# Altium schematic sheet Conn_C.SchDoc
size A1
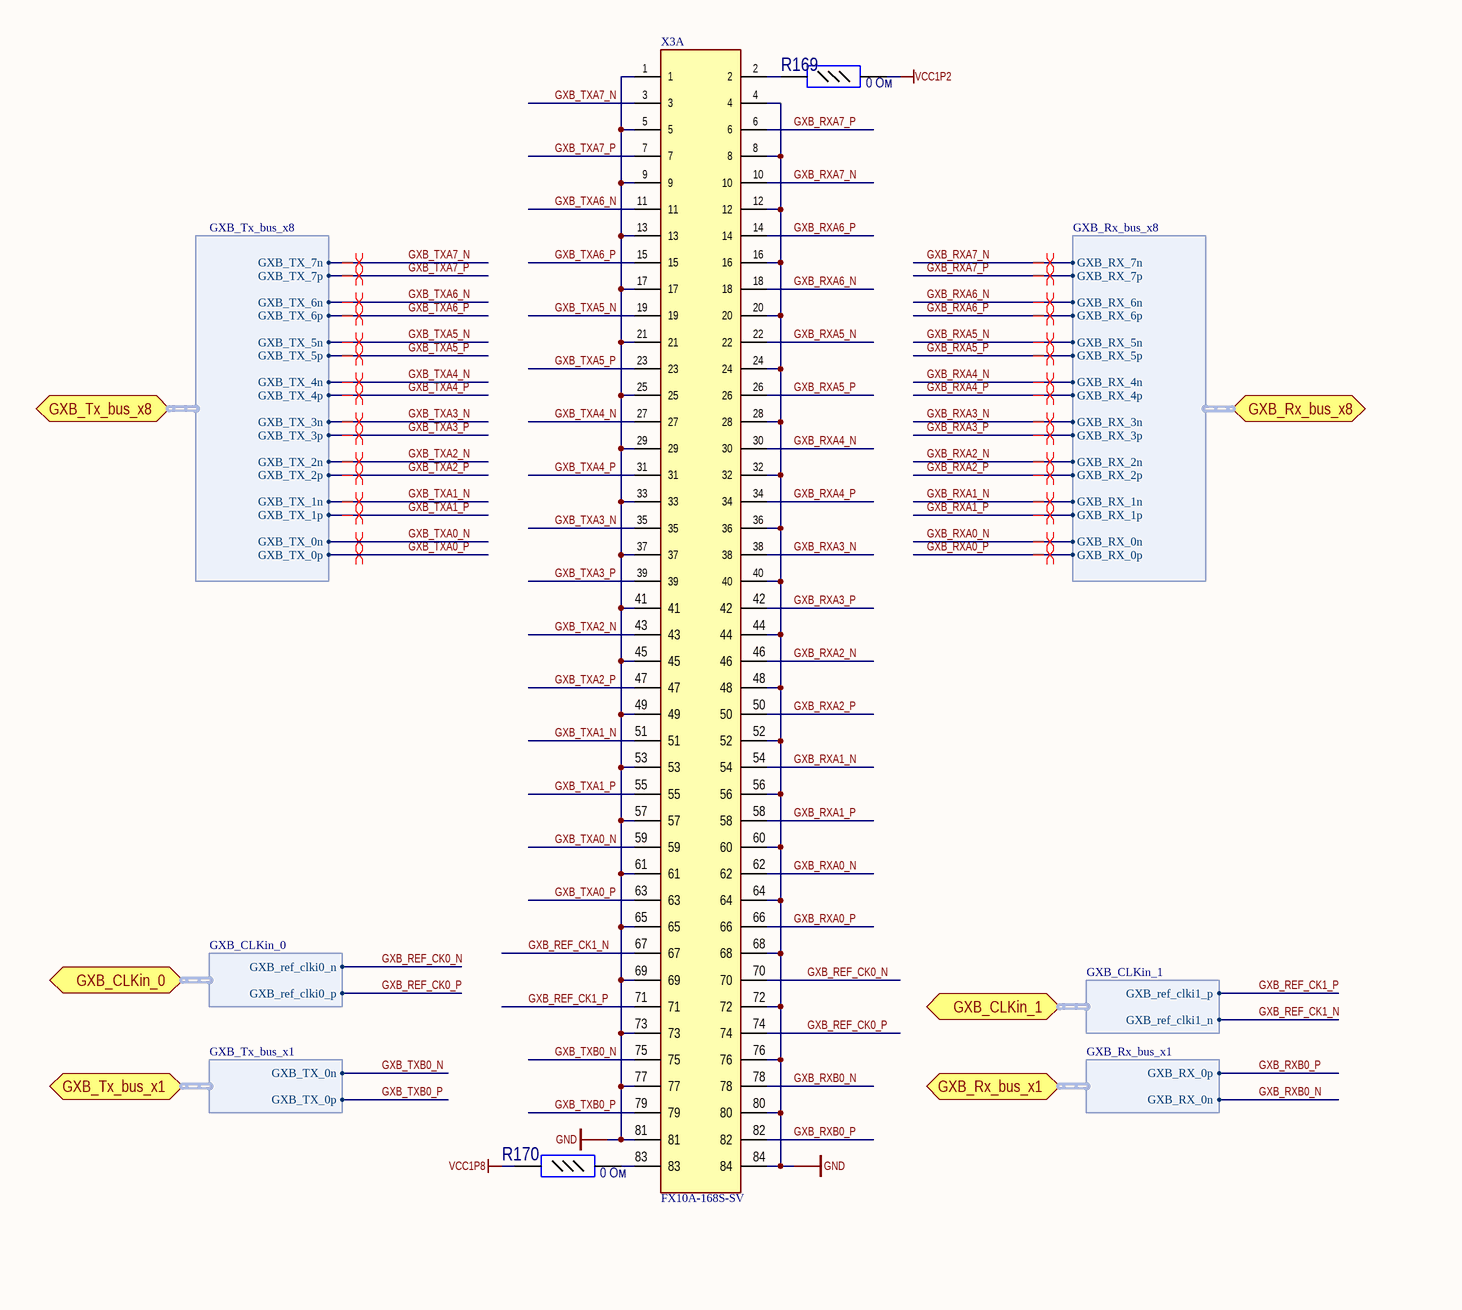
[diagram p0: Conn_C.SchDoc, left]
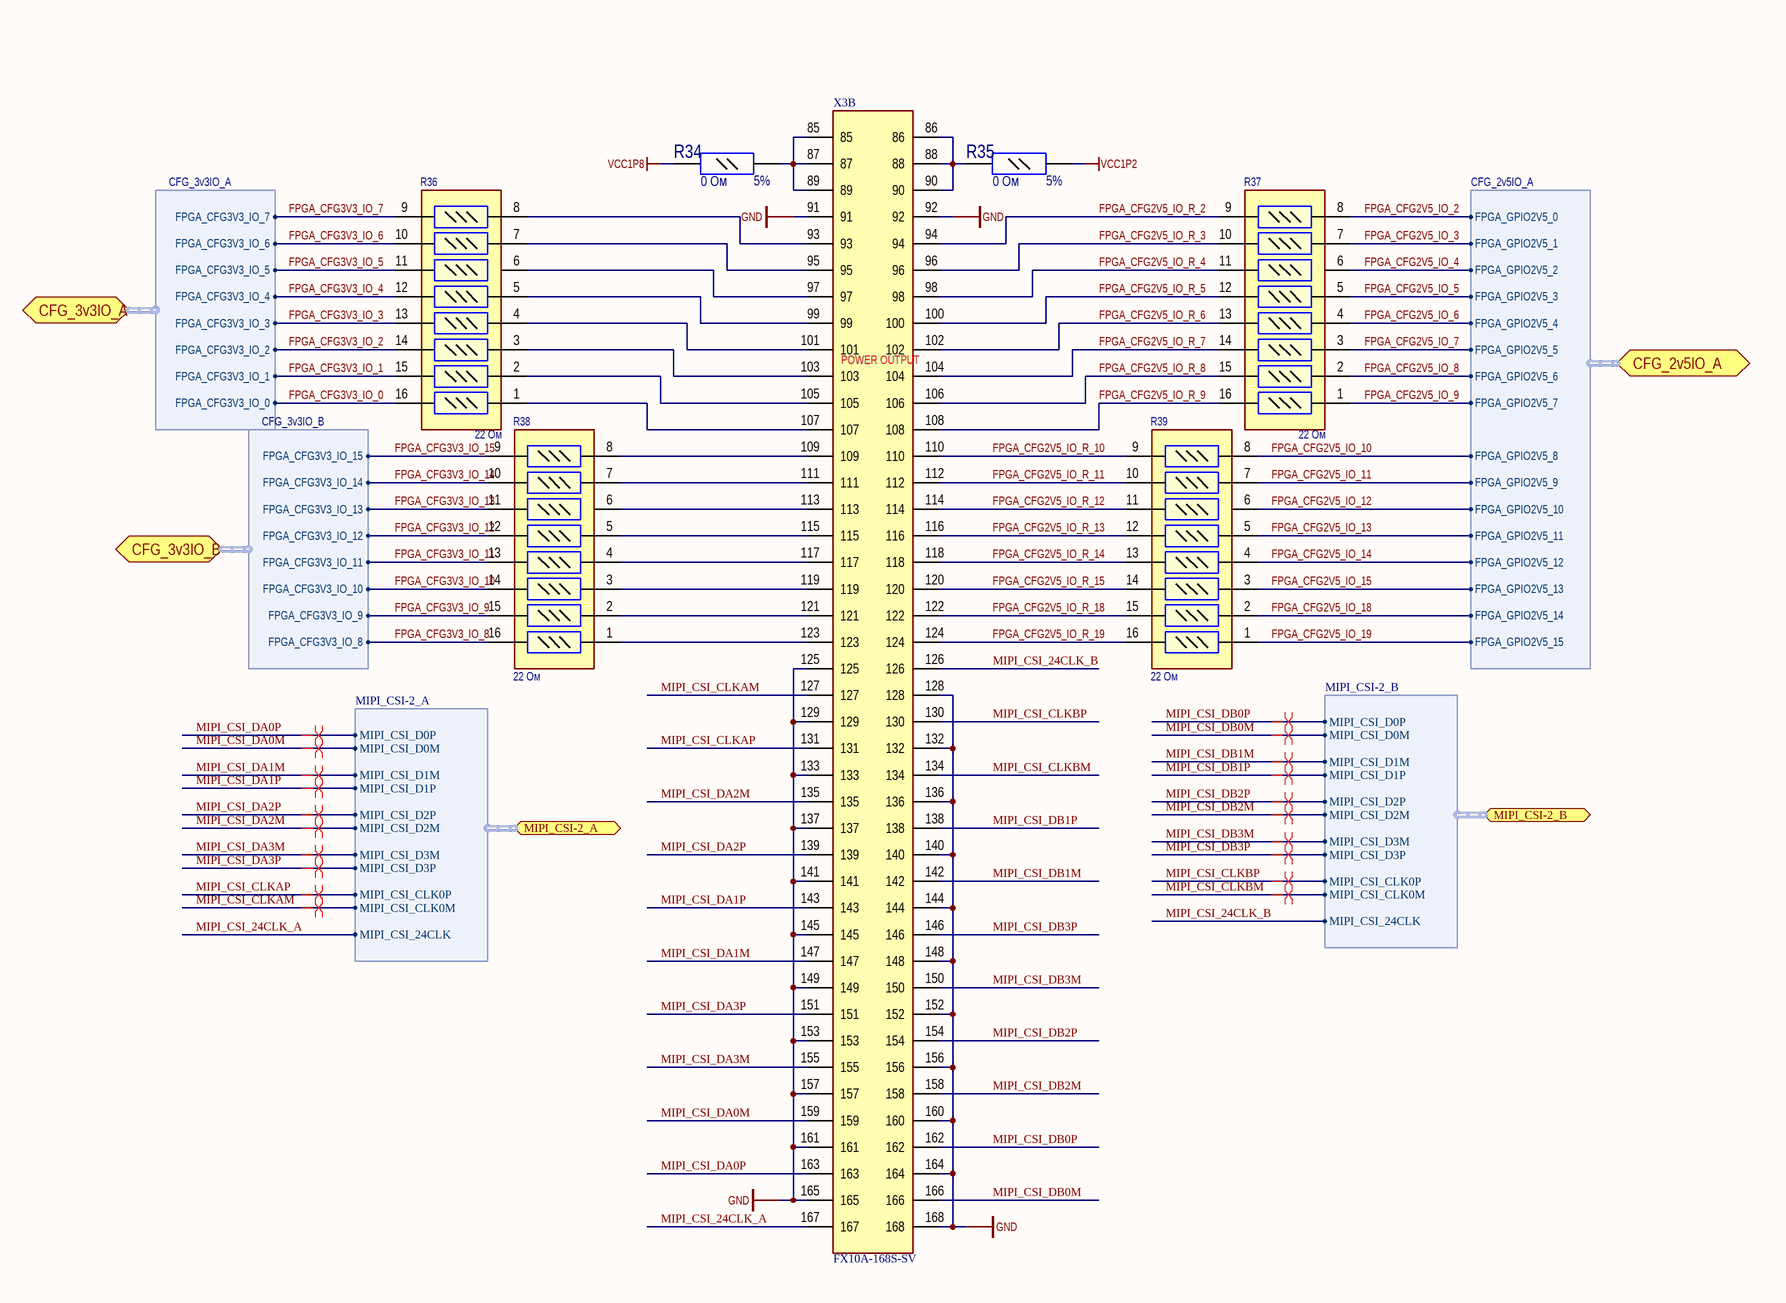
[diagram p1: Conn_C.SchDoc, right]

## Parts
R34  value 0 Ом  TOLERANCE: 5%  [CR0805]  (hidden comment: CR0805-0 Ом-±5%)
R35  value 0 Ом  TOLERANCE: 5%  [CR0805]  (hidden comment: CR0805-0 Ом-±5%)
R36  value 22 Ом  [CAT16-J8]  (hidden comment: YC248-JR-07-22 Ом)
R37  value 22 Ом  [CAT16-J8]  (hidden comment: YC248-JR-07-22 Ом)
R38  value 22 Ом  [CAT16-J8]  (hidden comment: YC248-JR-07-22 Ом)
R39  value 22 Ом  [CAT16-J8]  (hidden comment: YC248-JR-07-22 Ом)
R169  value 0 Ом  [CR0603]  (hidden comment: CR0603-0 Ом-±5%)
R170  value 0 Ом  [CR0603]  (hidden comment: CR0603-0 Ом-±5%)
X3  FX10A-168S-SV  [FX10A-168S-SV]  (parts A,B of 2)

## Ports
CFG_2v5IO_A (harness CFG_2v5IO_A), CFG_3v3IO_A (harness CFG_3v3IO_A), CFG_3v3IO_B (harness CFG_3v3IO_B), GXB_CLKin_0 (harness GXB_CLKin_0), GXB_CLKin_1 (harness GXB_CLKin_1), GXB_Rx_bus_x1 (harness GXB_Rx_bus_x1), GXB_Rx_bus_x8 (harness GXB_Rx_bus_x8), GXB_Tx_bus_x1 (harness GXB_Tx_bus_x1), GXB_Tx_bus_x8 (harness GXB_Tx_bus_x8), MIPI_CSI-2_A (harness MIPI_CSI-2_A), MIPI_CSI-2_B (harness MIPI_CSI-2_B)

## Harnesses
GXB_CLKin_0: GXB_ref_clki0_p, GXB_ref_clki0_n
GXB_Rx_bus_x1: GXB_RX_0p, GXB_RX_0n
GXB_CLKin_1: GXB_ref_clki1_p, GXB_ref_clki1_n
GXB_Tx_bus_x8: GXB_TX_0p, GXB_TX_0n, GXB_TX_1p, GXB_TX_1n, GXB_TX_2p, GXB_TX_2n, GXB_TX_3p, GXB_TX_3n, GXB_TX_4p, GXB_TX_4n, GXB_TX_5p, GXB_TX_5n, GXB_TX_6p, GXB_TX_6n, GXB_TX_7p, GXB_TX_7n
GXB_Tx_bus_x1: GXB_TX_0p, GXB_TX_0n
MIPI_CSI-2_A: MIPI_CSI_D0P, MIPI_CSI_D0M, MIPI_CSI_D1M, MIPI_CSI_D1P, MIPI_CSI_D2P, MIPI_CSI_D2M, MIPI_CSI_D3M, MIPI_CSI_D3P, MIPI_CSI_CLK0P, MIPI_CSI_CLK0M, MIPI_CSI_24CLK
MIPI_CSI-2_B: MIPI_CSI_D0P, MIPI_CSI_D0M, MIPI_CSI_D1M, MIPI_CSI_D1P, MIPI_CSI_CLK0P, MIPI_CSI_CLK0M, MIPI_CSI_24CLK, MIPI_CSI_D2P, MIPI_CSI_D2M, MIPI_CSI_D3M, MIPI_CSI_D3P
CFG_3v3IO_A: FPGA_CFG3V3_IO_0, FPGA_CFG3V3_IO_1, FPGA_CFG3V3_IO_2, FPGA_CFG3V3_IO_3, FPGA_CFG3V3_IO_4, FPGA_CFG3V3_IO_5, FPGA_CFG3V3_IO_6, FPGA_CFG3V3_IO_7
CFG_3v3IO_B: FPGA_CFG3V3_IO_8, FPGA_CFG3V3_IO_9, FPGA_CFG3V3_IO_10, FPGA_CFG3V3_IO_11, FPGA_CFG3V3_IO_12, FPGA_CFG3V3_IO_13, FPGA_CFG3V3_IO_14, FPGA_CFG3V3_IO_15
CFG_2v5IO_A: FPGA_GPIO2V5_0, FPGA_GPIO2V5_1, FPGA_GPIO2V5_2, FPGA_GPIO2V5_3, FPGA_GPIO2V5_4, FPGA_GPIO2V5_5, FPGA_GPIO2V5_6, FPGA_GPIO2V5_7, FPGA_GPIO2V5_8, FPGA_GPIO2V5_9, FPGA_GPIO2V5_10, FPGA_GPIO2V5_11, FPGA_GPIO2V5_12, FPGA_GPIO2V5_13, FPGA_GPIO2V5_14, FPGA_GPIO2V5_15
GXB_Rx_bus_x8: GXB_RX_0p, GXB_RX_0n, GXB_RX_1p, GXB_RX_1n, GXB_RX_2p, GXB_RX_2n, GXB_RX_3p, GXB_RX_3n, GXB_RX_4p, GXB_RX_4n, GXB_RX_5p, GXB_RX_5n, GXB_RX_6p, GXB_RX_6n, GXB_RX_7p, GXB_RX_7n

## Nets
GND: X3.1 X3.4 X3.5 X3.8 X3.9 X3.12 X3.13 X3.16 X3.17 X3.20 X3.21 X3.24 X3.25 X3.28 X3.29 X3.32 X3.33 X3.36 X3.37 X3.40 X3.41 X3.44 X3.45 X3.48 X3.49 X3.52 X3.53 X3.56 X3.57 X3.60 X3.61 X3.64 X3.65 X3.68 X3.69 X3.72 X3.73 X3.76 X3.77 X3.80 X3.81 X3.84 X3.91 X3.92 X3.125 X3.128 X3.129 X3.132 X3.133 X3.136 X3.137 X3.140 X3.141 X3.144 X3.145 X3.148 X3.149 X3.152 X3.153 X3.156 X3.157 X3.160 X3.161 X3.164 X3.165 X3.168
VCC1P2: R35.2(-) R169.2(-)
VCC1P8: R34.1(+) R170.1(+)
FPGA_CFG2V5_IO_2: R37.8 ; port CFG_2v5IO_A.FPGA_GPIO2V5_0
FPGA_CFG2V5_IO_3: R37.7 ; port CFG_2v5IO_A.FPGA_GPIO2V5_1
FPGA_CFG2V5_IO_4: R37.6 ; port CFG_2v5IO_A.FPGA_GPIO2V5_2
FPGA_CFG2V5_IO_5: R37.5 ; port CFG_2v5IO_A.FPGA_GPIO2V5_3
FPGA_CFG2V5_IO_6: R37.4 ; port CFG_2v5IO_A.FPGA_GPIO2V5_4
FPGA_CFG2V5_IO_7: R37.3 ; port CFG_2v5IO_A.FPGA_GPIO2V5_5
FPGA_CFG2V5_IO_8: R37.2 ; port CFG_2v5IO_A.FPGA_GPIO2V5_6
FPGA_CFG2V5_IO_9: R37.1 ; port CFG_2v5IO_A.FPGA_GPIO2V5_7
FPGA_CFG2V5_IO_10: R39.8 ; port CFG_2v5IO_A.FPGA_GPIO2V5_8
FPGA_CFG2V5_IO_11: R39.7 ; port CFG_2v5IO_A.FPGA_GPIO2V5_9
FPGA_CFG2V5_IO_12: R39.6 ; port CFG_2v5IO_A.FPGA_GPIO2V5_10
FPGA_CFG2V5_IO_13: R39.5 ; port CFG_2v5IO_A.FPGA_GPIO2V5_11
FPGA_CFG2V5_IO_14: R39.4 ; port CFG_2v5IO_A.FPGA_GPIO2V5_12
FPGA_CFG2V5_IO_15: R39.3 ; port CFG_2v5IO_A.FPGA_GPIO2V5_13
FPGA_CFG2V5_IO_18: R39.2 ; port CFG_2v5IO_A.FPGA_GPIO2V5_14
FPGA_CFG2V5_IO_19: R39.1 ; port CFG_2v5IO_A.FPGA_GPIO2V5_15
FPGA_CFG2V5_IO_R_2: R37.9 X3.94
FPGA_CFG2V5_IO_R_3: R37.10 X3.96
FPGA_CFG2V5_IO_R_4: R37.11 X3.98
FPGA_CFG2V5_IO_R_5: R37.12 X3.100
FPGA_CFG2V5_IO_R_6: R37.13 X3.102
FPGA_CFG2V5_IO_R_7: R37.14 X3.104
FPGA_CFG2V5_IO_R_8: R37.15 X3.106
FPGA_CFG2V5_IO_R_9: R37.16 X3.108
FPGA_CFG2V5_IO_R_10: R39.9 X3.110
FPGA_CFG2V5_IO_R_11: R39.10 X3.112
FPGA_CFG2V5_IO_R_12: R39.11 X3.114
FPGA_CFG2V5_IO_R_13: R39.12 X3.116
FPGA_CFG2V5_IO_R_14: R39.13 X3.118
FPGA_CFG2V5_IO_R_15: R39.14 X3.120
FPGA_CFG2V5_IO_R_18: R39.15 X3.122
FPGA_CFG2V5_IO_R_19: R39.16 X3.124
FPGA_CFG3V3_IO_0: R36.16 ; port CFG_3v3IO_A.FPGA_CFG3V3_IO_0
FPGA_CFG3V3_IO_1: R36.15 ; port CFG_3v3IO_A.FPGA_CFG3V3_IO_1
FPGA_CFG3V3_IO_2: R36.14 ; port CFG_3v3IO_A.FPGA_CFG3V3_IO_2
FPGA_CFG3V3_IO_3: R36.13 ; port CFG_3v3IO_A.FPGA_CFG3V3_IO_3
FPGA_CFG3V3_IO_4: R36.12 ; port CFG_3v3IO_A.FPGA_CFG3V3_IO_4
FPGA_CFG3V3_IO_5: R36.11 ; port CFG_3v3IO_A.FPGA_CFG3V3_IO_5
FPGA_CFG3V3_IO_6: R36.10 ; port CFG_3v3IO_A.FPGA_CFG3V3_IO_6
FPGA_CFG3V3_IO_7: R36.9 ; port CFG_3v3IO_A.FPGA_CFG3V3_IO_7
FPGA_CFG3V3_IO_8: R38.16 ; port CFG_3v3IO_B.FPGA_CFG3V3_IO_8
FPGA_CFG3V3_IO_9: R38.15 ; port CFG_3v3IO_B.FPGA_CFG3V3_IO_9
FPGA_CFG3V3_IO_10: R38.14 ; port CFG_3v3IO_B.FPGA_CFG3V3_IO_10
FPGA_CFG3V3_IO_11: R38.13 ; port CFG_3v3IO_B.FPGA_CFG3V3_IO_11
FPGA_CFG3V3_IO_12: R38.12 ; port CFG_3v3IO_B.FPGA_CFG3V3_IO_12
FPGA_CFG3V3_IO_13: R38.11 ; port CFG_3v3IO_B.FPGA_CFG3V3_IO_13
FPGA_CFG3V3_IO_14: R38.10 ; port CFG_3v3IO_B.FPGA_CFG3V3_IO_14
FPGA_CFG3V3_IO_15: R38.9 ; port CFG_3v3IO_B.FPGA_CFG3V3_IO_15
GXB_REF_CK0_N: X3.70 ; port GXB_CLKin_0.GXB_ref_clki0_n
GXB_REF_CK0_P: X3.74 ; port GXB_CLKin_0.GXB_ref_clki0_p
GXB_REF_CK1_N: X3.67 ; port GXB_CLKin_1.GXB_ref_clki1_n
GXB_REF_CK1_P: X3.71 ; port GXB_CLKin_1.GXB_ref_clki1_p
GXB_RXA0_N: X3.62 ; port GXB_Rx_bus_x8.GXB_RX_0n
GXB_RXA0_P: X3.66 ; port GXB_Rx_bus_x8.GXB_RX_0p
GXB_RXA1_N: X3.54 ; port GXB_Rx_bus_x8.GXB_RX_1n
GXB_RXA1_P: X3.58 ; port GXB_Rx_bus_x8.GXB_RX_1p
GXB_RXA2_N: X3.46 ; port GXB_Rx_bus_x8.GXB_RX_2n
GXB_RXA2_P: X3.50 ; port GXB_Rx_bus_x8.GXB_RX_2p
GXB_RXA3_N: X3.38 ; port GXB_Rx_bus_x8.GXB_RX_3n
GXB_RXA3_P: X3.42 ; port GXB_Rx_bus_x8.GXB_RX_3p
GXB_RXA4_N: X3.30 ; port GXB_Rx_bus_x8.GXB_RX_4n
GXB_RXA4_P: X3.34 ; port GXB_Rx_bus_x8.GXB_RX_4p
GXB_RXA5_N: X3.22 ; port GXB_Rx_bus_x8.GXB_RX_5n
GXB_RXA5_P: X3.26 ; port GXB_Rx_bus_x8.GXB_RX_5p
GXB_RXA6_N: X3.18 ; port GXB_Rx_bus_x8.GXB_RX_6n
GXB_RXA6_P: X3.14 ; port GXB_Rx_bus_x8.GXB_RX_6p
GXB_RXA7_N: X3.10 ; port GXB_Rx_bus_x8.GXB_RX_7n
GXB_RXA7_P: X3.6 ; port GXB_Rx_bus_x8.GXB_RX_7p
GXB_RXB0_N: X3.78 ; port GXB_Rx_bus_x1.GXB_RX_0n
GXB_RXB0_P: X3.82 ; port GXB_Rx_bus_x1.GXB_RX_0p
GXB_TXA0_N: X3.59 ; port GXB_Tx_bus_x8.GXB_TX_0n
GXB_TXA0_P: X3.63 ; port GXB_Tx_bus_x8.GXB_TX_0p
GXB_TXA1_N: X3.51 ; port GXB_Tx_bus_x8.GXB_TX_1n
GXB_TXA1_P: X3.55 ; port GXB_Tx_bus_x8.GXB_TX_1p
GXB_TXA2_N: X3.43 ; port GXB_Tx_bus_x8.GXB_TX_2n
GXB_TXA2_P: X3.47 ; port GXB_Tx_bus_x8.GXB_TX_2p
GXB_TXA3_N: X3.35 ; port GXB_Tx_bus_x8.GXB_TX_3n
GXB_TXA3_P: X3.39 ; port GXB_Tx_bus_x8.GXB_TX_3p
GXB_TXA4_N: X3.27 ; port GXB_Tx_bus_x8.GXB_TX_4n
GXB_TXA4_P: X3.31 ; port GXB_Tx_bus_x8.GXB_TX_4p
GXB_TXA5_N: X3.19 ; port GXB_Tx_bus_x8.GXB_TX_5n
GXB_TXA5_P: X3.23 ; port GXB_Tx_bus_x8.GXB_TX_5p
GXB_TXA6_N: X3.11 ; port GXB_Tx_bus_x8.GXB_TX_6n
GXB_TXA6_P: X3.15 ; port GXB_Tx_bus_x8.GXB_TX_6p
GXB_TXA7_N: X3.3 ; port GXB_Tx_bus_x8.GXB_TX_7n
GXB_TXA7_P: X3.7 ; port GXB_Tx_bus_x8.GXB_TX_7p
GXB_TXB0_N: X3.75 ; port GXB_Tx_bus_x1.GXB_TX_0n
GXB_TXB0_P: X3.79 ; port GXB_Tx_bus_x1.GXB_TX_0p
MIPI_CSI_24CLK_A: X3.167 ; port MIPI_CSI-2_A.MIPI_CSI_24CLK
MIPI_CSI_24CLK_B: X3.126 ; port MIPI_CSI-2_B.MIPI_CSI_24CLK
MIPI_CSI_CLKAM: X3.127 ; port MIPI_CSI-2_A.MIPI_CSI_CLK0M
MIPI_CSI_CLKAP: X3.131 ; port MIPI_CSI-2_A.MIPI_CSI_CLK0P
MIPI_CSI_CLKBM: X3.134 ; port MIPI_CSI-2_B.MIPI_CSI_CLK0M
MIPI_CSI_CLKBP: X3.130 ; port MIPI_CSI-2_B.MIPI_CSI_CLK0P
MIPI_CSI_DA0M: X3.159 ; port MIPI_CSI-2_A.MIPI_CSI_D0M
MIPI_CSI_DA0P: X3.163 ; port MIPI_CSI-2_A.MIPI_CSI_D0P
MIPI_CSI_DA1M: X3.147 ; port MIPI_CSI-2_A.MIPI_CSI_D1M
MIPI_CSI_DA1P: X3.143 ; port MIPI_CSI-2_A.MIPI_CSI_D1P
MIPI_CSI_DA2M: X3.135 ; port MIPI_CSI-2_A.MIPI_CSI_D2M
MIPI_CSI_DA2P: X3.139 ; port MIPI_CSI-2_A.MIPI_CSI_D2P
MIPI_CSI_DA3M: X3.155 ; port MIPI_CSI-2_A.MIPI_CSI_D3M
MIPI_CSI_DA3P: X3.151 ; port MIPI_CSI-2_A.MIPI_CSI_D3P
MIPI_CSI_DB0M: X3.166 ; port MIPI_CSI-2_B.MIPI_CSI_D0M
MIPI_CSI_DB0P: X3.162 ; port MIPI_CSI-2_B.MIPI_CSI_D0P
MIPI_CSI_DB1M: X3.142 ; port MIPI_CSI-2_B.MIPI_CSI_D1M
MIPI_CSI_DB1P: X3.138 ; port MIPI_CSI-2_B.MIPI_CSI_D1P
MIPI_CSI_DB2M: X3.158 ; port MIPI_CSI-2_B.MIPI_CSI_D2M
MIPI_CSI_DB2P: X3.154 ; port MIPI_CSI-2_B.MIPI_CSI_D2P
MIPI_CSI_DB3M: X3.150 ; port MIPI_CSI-2_B.MIPI_CSI_D3M
MIPI_CSI_DB3P: X3.146 ; port MIPI_CSI-2_B.MIPI_CSI_D3P
NetR34_2: R34.2(-) X3.85 X3.87 X3.89
NetR35_1: R35.1(+) X3.86 X3.88 X3.90
NetR36_1: R36.1 X3.107
NetR36_2: R36.2 X3.105
NetR36_3: R36.3 X3.103
NetR36_4: R36.4 X3.101
NetR36_5: R36.5 X3.99
NetR36_6: R36.6 X3.97
NetR36_7: R36.7 X3.95
NetR36_8: R36.8 X3.93
NetR38_1: R38.1 X3.123
NetR38_2: R38.2 X3.121
NetR38_3: R38.3 X3.119
NetR38_4: R38.4 X3.117
NetR38_5: R38.5 X3.115
NetR38_6: R38.6 X3.113
NetR38_7: R38.7 X3.111
NetR38_8: R38.8 X3.109
NetR169_1: R169.1(+) X3.2
NetR170_2: R170.2(-) X3.83

## Layout directives
differential pair: GXB_RXA0_N, GXB_RXA0_P, GXB_RXA1_N, GXB_RXA1_P, GXB_RXA2_N, GXB_RXA2_P, GXB_RXA3_N, GXB_RXA3_P, GXB_RXA4_N, GXB_RXA4_P, GXB_RXA5_N, GXB_RXA5_P, GXB_RXA6_N, GXB_RXA6_P, GXB_RXA7_N, GXB_RXA7_P, GXB_TXA0_N, GXB_TXA0_P, GXB_TXA1_N, GXB_TXA1_P, GXB_TXA2_N, GXB_TXA2_P, GXB_TXA3_N, GXB_TXA3_P, GXB_TXA4_N, GXB_TXA4_P, GXB_TXA5_N, GXB_TXA5_P, GXB_TXA6_N, GXB_TXA6_P, GXB_TXA7_N, GXB_TXA7_P, MIPI_CSI_CLKAM, MIPI_CSI_CLKAP, MIPI_CSI_CLKBM, MIPI_CSI_CLKBP, MIPI_CSI_DA0M, MIPI_CSI_DA0P, MIPI_CSI_DA1M, MIPI_CSI_DA1P, MIPI_CSI_DA2M, MIPI_CSI_DA2P, MIPI_CSI_DA3M, MIPI_CSI_DA3P, MIPI_CSI_DB0M, MIPI_CSI_DB0P, MIPI_CSI_DB1M, MIPI_CSI_DB1P, MIPI_CSI_DB2M, MIPI_CSI_DB2P, MIPI_CSI_DB3M, MIPI_CSI_DB3P

## Notes on the sheet
- (near X3) POWER OUTPUT

## Library data of the parts
R34 R35 = CR0805-#-±1%: Чип резистор
R36-R39 = YC248-JR-07-#: Набор чип резисторов; P: 0.062 Вт; Supplier 1: Digi-Key; Supplier Part Number 1: YC248-JR-0722RL
R169 R170 = CR0603-#-±5%: Чип резистор